# Altium schematic sheet AnalogConnector.SchDoc
size A4; CompanyName: Technische Hochschule Nürnberg Georg Simon Ohm; Organization: UltraZohm; Address1: Kesslerplatz 12; Address2: 90489 Nürnberg; Address3: GERMANY; DocumentNumber: 4; SheetNumber: 4; SheetTotal: 6; Website: www.ultrazohm.com
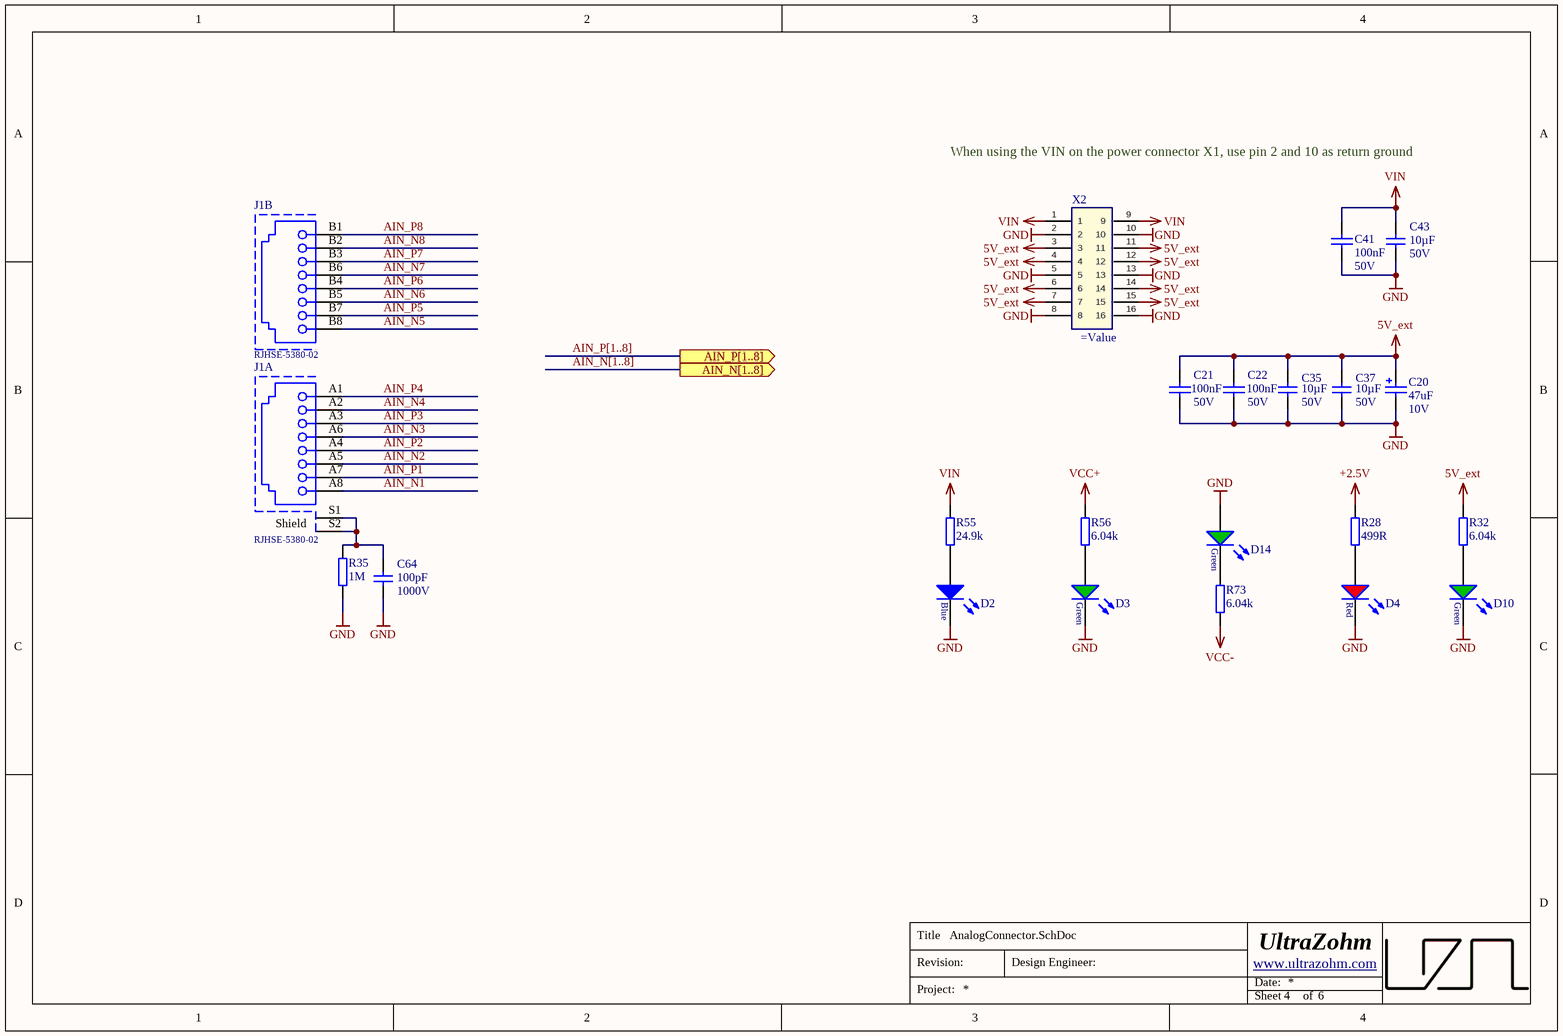
[diagram p0: AnalogConnector.SchDoc]

## Parts
C20  47uF  Voltage: 10V  [WCAP-ASLI_5x5.5]
C21  100nF  Voltage: 50V  [CAPC1608X07N]
C22  100nF  Voltage: 50V  [CAPC1608X07N]
C35  10µF  Voltage: 50V  [C_1206]
C37  10µF  Voltage: 50V  [C_1206]
C41  100nF  Voltage: 50V  [CAPC1608X07N]
C43  10µF  Voltage: 50V  [C_1206]
C64  100pF  Voltage: 1000V  [C_1206]
D2  150060BS75000  [WL-SMCW_0603]  (value not drawn)
D3  150060GS75000  [WL-SMCW_0603]  (value not drawn)
D4  150060RS75000  [WL-SMCW_0603]  (value not drawn)
D10  150060GS75000  [WL-SMCW_0603]  (value not drawn)
D14  150060GS75000  [WL-SMCW_0603]  (value not drawn)
J1  RJHSE-5380-02  [RJHSE-5380-02]  (parts A,B of 2)
R28  499R  [RESC1608X06N]
R32  6.04k  [RESC1608X06N]
R35  1M  [RESC1608X06N]
R55  24.9k  [RESC1608X06N]
R56  6.04k  [RESC1608X06N]
R73  6.04k  [RESC1608X06N]
X2  (no value)  [IPL1-108-01-L-D-RA-K]

## Ports
AIN_N[1..8] (out), AIN_P[1..8] (out)

## Nets
5V_ext: C20.2(P) C21.2 C22.2 C35.2 C37.2 R32.2 X2.3 X2.4 X2.6 X2.7 X2.11 X2.12 X2.14 X2.15
+2.5V: R28.2
GND: C20.1(N) C21.1 C22.1 C35.1 C37.1 C41.1 C43.1 C64.1 D2.1(K) D3.1(K) D4.1(K) D10.1(K) D14.2(A) R35.1 X2.2 X2.5 X2.8 X2.10 X2.13 X2.16
VCC+: R56.2
VCC-: R73.1
VIN: C41.2 C43.2 R55.2 X2.1 X2.9
AIN_N1: J1.A8
AIN_N2: J1.A5
AIN_N3: J1.A6
AIN_N4: J1.A2
AIN_N5: J1.B8
AIN_N6: J1.B5
AIN_N7: J1.B6
AIN_N8: J1.B2
AIN_P1: J1.A7
AIN_P2: J1.A4
AIN_P3: J1.A3
AIN_P4: J1.A1
AIN_P5: J1.B7
AIN_P6: J1.B4
AIN_P7: J1.B3
AIN_P8: J1.B1
NetC64_2: C64.2 J1.S1 J1.S2 R35.2
NetD2_2: D2.2(A) R55.1
NetD3_2: D3.2(A) R56.1
NetD4_2: D4.2(A) R28.1
NetD10_2: D10.2(A) R32.1
NetD14_1: D14.1(K) R73.2

## Buses and harness runs
bus AIN_N[1..8] = port AIN_N[1..8]
bus AIN_P[1..8] = port AIN_P[1..8]

## Notes on the sheet
- When using the VIN on the power connector X1, use pin 2 and 10 as return ground
- (near J1) Shield
- Title
- Revision:
- Design Engineer:
- Date:
- Project:
- Sheet
- of

## Library data of the parts
C20 = 865080142007: WCAP-ASLI Aluminum Electrolytic Capacitor, V-Chip, SMT, D5xH5.5mm, 47uF, 10V; MPN: 865080242004; Dissipation Factor: 24%; Endurance: 2000h; Leakage Current: 6.3uA; MF: Wurth Elektronik; Ripple Current: 170mA; Capacitance Tolerance: +/-20%; Technical Reference: ASEC055101M6R3DVCTBB000; ComponentLink1Description: Manufacturer; ComponentLink1URL: http://www.we-online.de; ComponentLink2Description: Datasheet; ComponentLink2URL: https://www.we-online.com/catalog/datasheet/865080142007.pdf; Height: 5.5mm; Mounting Technology: SMT; Operating Temperature: -55 to +105degC; Packaging: Tape and Reel; Published Date: May 2020; Diameter: 5mm; Supplier 1: Mouser; Supplier Part Number 1: 710-865080242004; Value: 47uF
C21 C22 = Cap_0603: MPN: CC0603KRX7R9BB104; MF: Yageo; Dielectric: X5R; Value: 100nF; Supplier 1: Mouser; Supplier 2: Mouser; Supplier Part Number 1: 603-CC603KRX7R9BB104; Supplier Part Number 2: 710-885382206004; Package: 0603
C35 C37 = C_1206: Capacitor 1206; MPN: CL31A106MBHNNNE; Tolerance: 10%; MF: Samsung; Dielectric: X5R; Package: 1206; Value: 10µF; Created: 2020_09_17_Liegmann; Supplier 1: Mouser; Supplier Part Number 1: 187-CL31A106MBHNNNE
C41 = Cap_0603: MPN: CC0603KRX7R9BB104; MF: Yageo; Tolerance: 10%; Dielectric: X5R; Value: 100nF; Supplier 1: Mouser; Supplier 2: Mouser; Supplier Part Number 1: 603-CC603KRX7R9BB104; Supplier Part Number 2: 710-885382206004; Package: 0603
C43 = C_1206: Capacitor 1206; MPN: CL31A106MBHNNNE; Tolerance: 20%; MF: Samsung; Dielectric: X5R; Package: 1206; Value: 10µF; Supplier 1: Mouser; Supplier Part Number 1: 187-CL31A106MBHNNNE
C64 = C_1206: Capacitor 1206; MPN: 885342008009; Tolerance: 5%; MF: Würth Elektronik; Dielectric: C0G; Package: 1206; Value: 100pF; Created: 2018_06_25_AGeiger; Supplier 1: Mouser; Supplier Part Number 1: 710-885342008009
D2 = LED_Blue_0603: WL-SMCW SMD Mono-color Chip LED Waterclear, size 0603, Blue, 3.2 V, 140°; Forward Voltage: 3.2 V; Luminous Intensity: 145 mcd; Peak Wavelength: 465 nm; Dominant Wavelength: 470 nm; MF: Wuerth Elektronik; Published Date: Sep. 2017; ComponentLink1Description: Manufacturer; ComponentLink1URL: http://www.we-online.de; ComponentLink2Description: Datasheet; ComponentLink2URL: http://katalog.we-online.com/led/datasheet/150060BS75000.pdf; MPN: 150060BS75000; Size: 0603; Viewing Angle: 140°; Emitting Color: Blue; Value: 150060BS75000; Package: 0603; Created: 2018_09_06_AGeiger; Supplier 1: Farnell; Supplier Part Number 1: 2322069; Supplier 2: Mouser; Supplier Part Number 2: 710-150060BS75000; Supplier 3: Digi-Key; Supplier Part Number 3: 732-4966-1-ND
D3 D10 D14 = LED_Green_0603: WL-SMCW SMD Mono-color Chip LED Waterclear, size 0603, Green, 3.2 V, 140°; Forward Voltage: 3.2 V; Luminous Intensity: 430 mcd; Peak Wavelength: 515 nm; Dominant Wavelength: 520 nm; MF: Wuerth Elektronik; Published Date: Sep. 2017; ComponentLink1Description: Manufacturer; ComponentLink1URL: http://www.we-online.de; ComponentLink2Description: Datasheet; ComponentLink2URL: http://katalog.we-online.com/led/datasheet/150060GS75000.pdf; MPN: 150060GS75000; Size: 0603; Viewing Angle: 140°; Emitting Color: Green; Value: 150060GS75000; Package: 0603; Created: 2018_09_06_AGeiger; Supplier 1: Farnell; Supplier Part Number 1: 2322070; Supplier 2: Mouser; Supplier Part Number 2: 710-150060GS75000; Supplier 3: Digi-Key; Supplier Part Number 3: 732-4971-1-ND
D4 = LED_Red_0603: WL-SMCW SMD Mono-color Chip LED Waterclear, size 0603, Red, 2 V, 140°; Forward Voltage: 2 V; Luminous Intensity: 250 mcd; Peak Wavelength: 630 nm; Dominant Wavelength: 625 nm; MF: Wuerth Elektronik; Published Date: Sep. 2017; ComponentLink1Description: Manufacturer; ComponentLink1URL: http://www.we-online.de; ComponentLink2Description: Datasheet; ComponentLink2URL: http://katalog.we-online.com/led/datasheet/150060RS75000.pdf; MPN: 150060RS75000; Size: 0603; Viewing Angle: 140°; Emitting Color: Red; Value: 150060RS75000; Package: 0603; Created: 2018_09_06_AGeiger; Supplier 1: Farnell; Supplier Part Number 1: 2322071; Supplier 2: Mouser; Supplier Part Number 2: 710-150060RS75000; Supplier 3: Digi-Key; Supplier Part Number 3: 732-4978-1-ND
J1 = RJHSE-5380-02: Modular Connectors / Ethernet Connectors CAT 5 MODULAR JACK HIGH TEMP; MF: Amphenol; Pin Number: 8P8C; Port: 1x2; Entrance: Right Angle; Compliance: Lead free / RoHS; Rated Current: 1.5 A; Working Voltage: 125 VAC; Withstanding Voltage: 1000 VAC; Contact Resistance: 20 mOhm; ComponentLink1Description: Manufacturer; ComponentLink1URL: https://www.amphenol-icc.com/; ComponentLink2Description: Datasheet; ComponentLink2URL: https://cdn.amphenol-icc.com/media/wysiwyg/files/documentation/datasheet/inputoutput/io-modjack-rjhse.pdf; MPN: RJHSE-5380-02; Published Date: July 2018; Operating Temperature: -55 to 85 degC; Mounting Technology: THT; Packaging: Tray; Supplier 1: Mouser; Supplier Part Number 1: 523-RJHSE-5380-02; ComponentLink3Description: Product Drawing; ComponentLink3URL: https://cdn.amphenol-icc.com/media/wysiwyg/files/drawing/rjhsex38002.pdf
R28 = R_0603: MPN: CRCW0603499RFKEAC; MF: Vishay / Dale; Value: 499R; Supplier 1: Mouser; Supplier Part Number 1: 71-CRCW0603499RFKEAC; Package: 0603
R32 R56 R73 = R_0603: MPN: RCS06036K04FKEA; MF: Vishay / Dale; Value: 6.04k; Supplier 1: Mouser; Supplier Part Number 1: 71-RCS06036K04FKEA; Package: 0603
R35 = R_0603: MPN: CRCW06031M00FKEAC; MF: Vishay / Dale; Tolerance: 1%; Value: 1M; Supplier 1: mouser; Supplier Part Number 1: 71-CRCW06031M00FKEAC; Package: 0603
R55 = R_0603: MPN: CRCW060324K9FKEAC; MF: Vishay / Dale; Value: 24.9k; Supplier 1: Mouser; Supplier Part Number 1: 71-CRCW060324K9FKEAC; Package: 0603
X2 = IPL1-108-XX-X-D-X: 2.54mm Double Row Terminal Assembly; MF: SAMTEC; Value: IPL1-108-01-L-D-RA-K; Created: 2018_09_17_AGeiger; MPN: IPL1-108-01-L-D-RA-K; Supplier 1: Mouser; Supplier Part Number 1: 200-IPL110801LDRAK